# Altium project MainBoard.PrjPcb
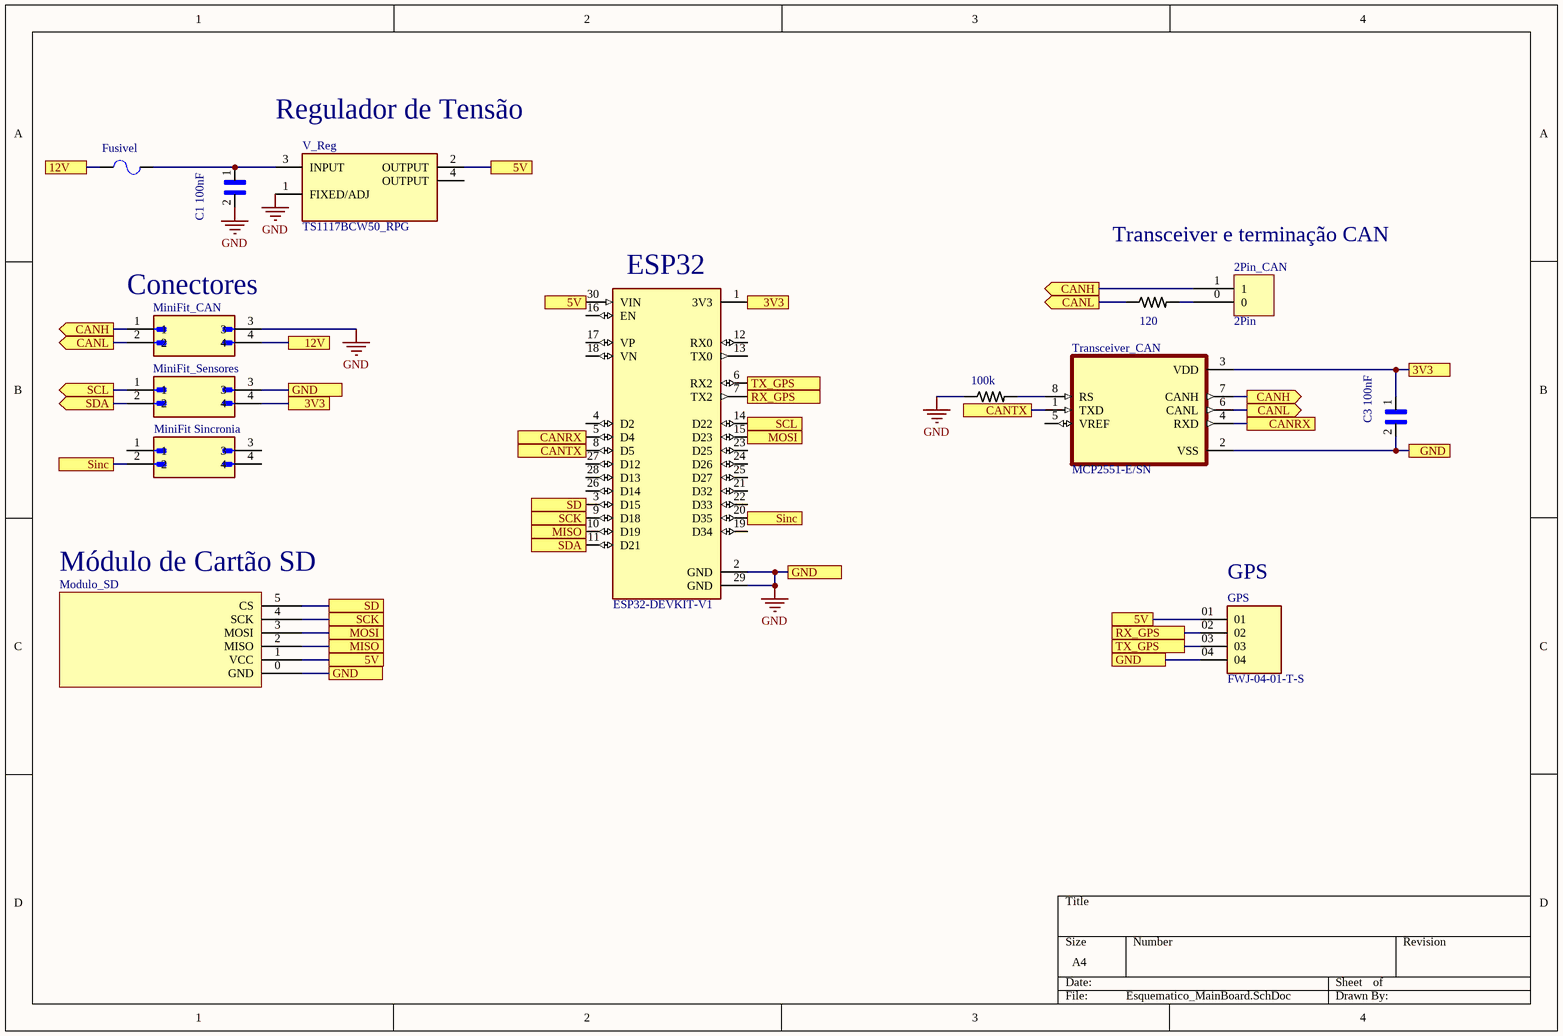
[diagram p0: Esquematico_MainBoard.SchDoc]
1 sheet, 14 parts. Net scope: flat (ports and power ports of the same name join across sheets).
Board file: PCB_MainBoard_GPS.PcbDoc

## Sheet Esquematico_MainBoard.SchDoc
size A4; SheetNumber: 1; SheetTotal: 1

### Parts
2Pin_CAN  2Pin  [2Pin]
100k  CRG1206F620K  [RESC3115X65N]  (value not drawn)
120  CRG1206F620K  [RESC3115X65N]  (value not drawn)
C1_100nF  C2012X5R1E225M085AC  [*CAPC2012X100N]  (value not drawn)
C3_100nF  C2012X5R1E225M085AC  [*CAPC2012X100N]  (value not drawn)
Fusivel  F1206B3R00FWTR  [*FUSM3216X140N]  (value not drawn)
GPS  FWJ-04-01-T-S  [SAMTEC_FWJ-04-01-T-S]
MiniFit_CAN  874270402  [MOLEX_874270402]  (value not drawn)
MiniFit_Sensores  874270402  [MOLEX_874270402]  (value not drawn)
MiniFit_Sincronia  874270402  [MOLEX_874270402]  (value not drawn)
Modulo_SD  Component_1  [MICROSD_MODULE]  (value not drawn)
Transceiver_CAN  MCP2551-E/SN  [SOIC127P600X175-8N]
V_Reg  TS1117BCW50_RPG  [VREG_TS1117BCW50_RPG]
  ESP32-DEVKIT-V1  [MODULE_ESP32_DEVKIT_V1]

### Ports
3V3, 5V, 12V, CANH (out), CANL (out), CANRX, CANTX, GND, MISO, MOSI, RX_GPS, SCK, SCL (out), SD, SDA (out), Sinc, TX_GPS

### Nets
GND: 100k.1 C1_100nF.2 C3_100nF.2 GPS.04 MiniFit_CAN.3 MiniFit_Sensores.3 Modulo_SD.0(GND) Transceiver_CAN.2(VSS) V_Reg.1(FIXED/ADJ) .2(GND) .29(GND) ; port GND
Net2Pin_CAN_0: 2Pin_CAN.0 120.2
Net2Pin_CAN_1: 2Pin_CAN.1 MiniFit_CAN.1 Transceiver_CAN.7(CANH) ; port CANH
Net100k_2: 100k.2 Transceiver_CAN.8(RS)
Net120_1: 120.1 MiniFit_CAN.2 Transceiver_CAN.6(CANL) ; port CANL
NetC1_100nF_1: C1_100nF.1 Fusivel.2 V_Reg.3(INPUT)
NetC3_100nF_1: C3_100nF.1 MiniFit_Sensores.4 Transceiver_CAN.3(VDD) .1(3V3) ; port 3V3
NetFusivel_1: Fusivel.1 MiniFit_CAN.4 ; port 12V
NetGPS_01: GPS.01 Modulo_SD.1(VCC) V_Reg.2(OUTPUT) .30(VIN) ; port 5V
NetGPS_02: GPS.02 .7(TX2) ; port RX_GPS
NetGPS_03: GPS.03 .6(RX2) ; port TX_GPS
NetMiniFit_Sensores_1: MiniFit_Sensores.1 .14(D22) ; port SCL
NetMiniFit_Sensores_2: MiniFit_Sensores.2 .11(D21) ; port SDA
NetMiniFit_Sincronia_2: MiniFit_Sincronia.2 .20(D35) ; port Sinc
NetModulo_SD_2: Modulo_SD.2(MISO) .10(D19) ; port MISO
NetModulo_SD_3: Modulo_SD.3(MOSI) .15(D23) ; port MOSI
NetModulo_SD_4: Modulo_SD.4(SCK) .9(D18) ; port SCK
NetModulo_SD_5: Modulo_SD.5(CS) .3(D15) ; port SD
NetTransceiver_CAN_1: Transceiver_CAN.1(TXD) .8(D5) ; port CANTX
NetTransceiver_CAN_4: Transceiver_CAN.4(RXD) .5(D4) ; port CANRX

Not connected (* = marked no-connect by the designer): MiniFit_Sincronia 1 3 4; Transceiver_CAN 5(VREF); V_Reg 4(OUTPUT);  4(D2) 12(RX0) 13(TX0) 16(EN) 17(VP) 18(VN) 19(D34) 21(D32) 22(D33) 23(D25) 24(D26) 25(D27) 26(D14) 27(D12) 28(D13)

### Notes on the sheet
- (near V_Reg) Regulador de Tensão
- Transceiver e terminação CAN
- (near MiniFit_CAN) Conectores
- ESP32
- (near Modulo_SD) Módulo de Cartão SD
- (near GPS) GPS

### Library data of the parts
100k 120 = CRG1206F620K: Res Thick Film 1206 620K Ohm 1% 0.25W_1/4W_ Â±100ppm/C Pad SMD T/R; MF: TE Connectivity; Package: 1206 TE Connectivity; Price: 0.00 USD; MP: CRG1206F620K; Availability: Unavailable; SnapEDA_Link: https://www.snapeda.com/parts/CRG1206F620K/TE%20Connectivity%20/%20DEUTSCH/view-part/?ref=snap; Value: *
C1_100nF C3_100nF = C2012X5R1E225M085AC: Cap Ceramic 2.2uF 25V X5R 20% SMD 0805 85Â°C Punched Paper T/R; MF: TDK; Package: 0805 TDK; MP: C2012X5R1E225M085AC; Availability: Unavailable; Price: None; SnapEDA_Link: https://www.snapeda.com/parts/C2012X5R1E225M085AC/TDK/view-part/?ref=snap; Value: *
Fusivel = F1206B3R00FWTR: F1206B Series Fast Acting 63 V 3 A 1206 Surface Mount Thin-Film Fuse T&R; MF: AVX; SnapEDA_Link: https://www.snapeda.com/parts/F1206B3R00FWTR/AVX%20/%20Kyocera/view-part/?ref=snap; Package: 1206 AVX; MP: F1206B3R00FWTR; Availability: Unavailable; Price: None; Value: *
GPS = FWJ-04-01-T-S: Connector Header Through Hole 4 position 0.156 (3.96mm); MF: Samtec; Availability: Bad; Package: None; Check_prices: https://www.snapeda.com/parts/FWJ-04-01-T-S/Samtec/view-part/3573755/?ref=eda; Price: None; SnapEDA_Link: https://www.snapeda.com/parts/FWJ-04-01-T-S/Samtec/view-part/3573755/?ref=snap; MP: FWJ-04-01-T-S; Purchase-URL: https://pricing.snapeda.com/search/part/FWJ-04-01-T-S/?ref=eda; Value: *
MiniFit_CAN MiniFit_Sensores MiniFit_Sincronia = 874270402: Conn Wire to Board HDR 4 POS 4.2mm Solder RA Side Entry Thru-Hole Mini-Fit Jrâ„¢ Tray; MF: Molex; MP: 874270402; Package: None; SnapEDA_Link: https://www.snapeda.com/parts/874270402/Molex/view-part/?ref=snap; Check_prices: https://www.snapeda.com/parts/874270402/Molex/view-part/?ref=eda; Availability: In Stock; Value: *; Purchase-URL: https://pricing.snapeda.com/search/part/874270402/?ref=eda; Price: None
Transceiver_CAN = MCP2551-E/SN: 1/1 Transceiver Half CANbus 8-SOIC; MF: Microchip; Check_prices: https://www.snapeda.com/parts/MCP2551-E/SN/Microchip/view-part/?ref=eda; Value: *; Availability: In Stock; MP: MCP2551-E/SN; Price: None; Package: SOIC-8 Microchip; SnapEDA_Link: https://www.snapeda.com/parts/MCP2551-E/SN/Microchip/view-part/?ref=snap; Purchase-URL: https://pricing.snapeda.com/search/part/MCP2551-E/SN/?ref=eda
V_Reg = TS1117BCW50_RPG: 1A 5V LOW DROPOUT VOLTAGE REGULATOR; MP: TS1117BCW50 RPG; MF: Taiwan Semiconductor; Availability: In Stock; Check_prices: https://www.snapeda.com/parts/TS1117BCW50%20RPG/Taiwan+Semiconductor/view-part/?ref=eda; Purchase-URL: https://pricing.snapeda.com/search/part/TS1117BCW50 RPG/?ref=eda; SnapEDA_Link: https://www.snapeda.com/parts/TS1117BCW50%20RPG/Taiwan+Semiconductor/view-part/?ref=snap; Value: *; Price: None; Package: SOT-223 Taiwan Semiconductor
 = ESP32-DEVKIT-V1: Dual core, Wi-Fi: 2.4 GHz up to 150 Mbits/s,BLE (Bluetooth Low Energy) and legacy Bluetooth, 32 bits, Up to 240 MHz; MF: Do it